# Altium schematic sheet amplifier-special.SchDoc
size A4
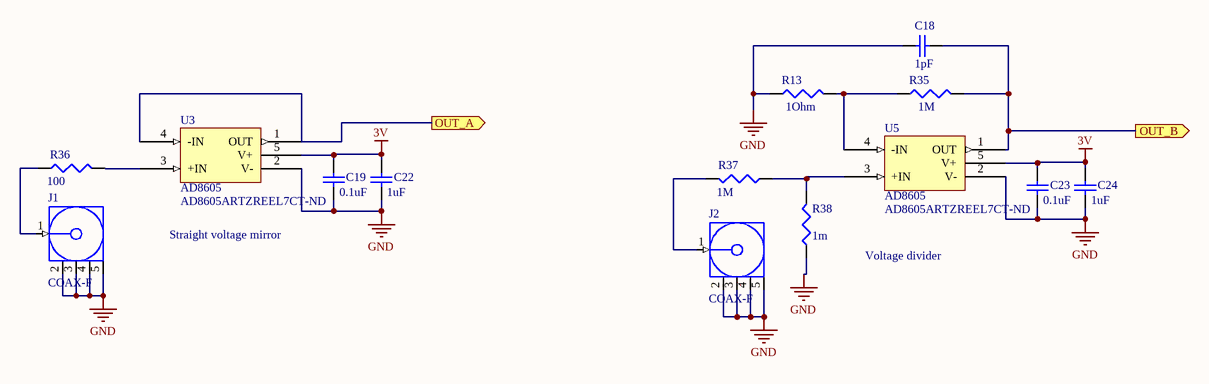
[diagram p0: amplifier-special.SchDoc]

## Parts
C18  value 1pF  [0402]  (hidden comment: 0.1uF)
C19  0.1uF  [0402]
C22  1uF  [1608[0603]]
C23  0.1uF  [0402]
C24  1uF  [1608[0603]]
J1  COAX-F  [MCX5.08-H5]
J2  COAX-F  [MCX5.08-H5]
R13  value 1Ohm  [J1-0603]  (hidden comment: 1 Ohm)
R35  1M  [0402]
R36  100  [0402]
R37  1M  [0402]
R38  1m  [14-1210]
U3  AD8605  Supplier Part Number 1: AD8605ARTZREEL7CT-ND  [SOP-65P200X125-5N]
U5  AD8605  Supplier Part Number 1: AD8605ARTZREEL7CT-ND  [SOP-65P200X125-5N]

## Ports
OUT_A (out), OUT_B (out)

## Nets
3V: C19.2 C22.2 C23.2 C24.2 U3.5(V+) U5.5(V+)
GND: C18.2 C19.1 C22.1 C23.1 C24.1 J1.2(GND) J1.3(GND) J1.4(GND) J1.5(GND) J2.2(GND) J2.3(GND) J2.4(GND) J2.5(GND) R13.1 R38.1 U3.2(V-) U5.2(V-)
OUT_A: U3.1(OUT) U3.4(-IN) ; port OUT_A
OUT_B: C18.1 R35.2 U5.1(OUT) ; port OUT_B
NetJ1_1: J1.1(Signal) R36.1
NetJ2_1: J2.1(Signal) R37.2
NetR13_2: R13.2 R35.1 U5.4(-IN)
NetR36_2: R36.2 U3.3(+IN)
NetR37_1: R37.1 R38.2 U5.3(+IN)

## Notes on the sheet
- Straight voltage mirror
- Voltage divider

## Library data of the parts
C18 C19 C22-C24 = Cap Semi: Capacitor (Semiconductor SIM Model); Published: 8-Jun-2000; LatestRevisionDate: 29-May-2009; LatestRevisionNote: IPC-7351 Footprint Added.; PackageReference: C1206; Publisher: Altium Limited; PackageDescription: Chip Capacitor; Supplier: Digi-Key
  C19 C23: Value: 0.1uF
  C22 C24: Value: 1uF
J1 J2 = COAX-F: RF Coaxial PCB Connector, MCX; Thru-Hole, Right-Angle Mount Socket, Blunt Post Terminal, 50 Ohm Impedance; PCB_Layout: Complies with manufacturer's recommendation.; DrillSize: Corresponds to nominal value.; Published: 15-Jul-2004; LatestRevisionDate: 15-Jul-2004; LatestRevisionNote: Component Replaced.; DatasheetDocument: 30-May-2003; PackageDocument: 04-Jul-1999; PackageReference: 919-119J-51AX; Publisher: Altium Limited; ComponentLink1Description: Manufacturer Link; ComponentLink1URL: http://www.amphenolrf.com/
R13 R35-R38 = Res3: Resistor; Published: 8-Jun-2000; LatestRevisionDate: 29-May-2009; LatestRevisionNote: IPC-7351 Footprint Added.; PackageReference: J1-0603; Publisher: Altium Limited; PackageDescription: Chip Resistor
  R35 R37: Value: 1M
  R36: Value: 100
  R38: Value: 1m
U3 U5 = AD8605: Low noise, precision rail-to-rail op-amp.; Supplier 1: Digi-Key; Supplier: Digi-Key